# Altium schematic sheet speaker.SchDoc
size A4
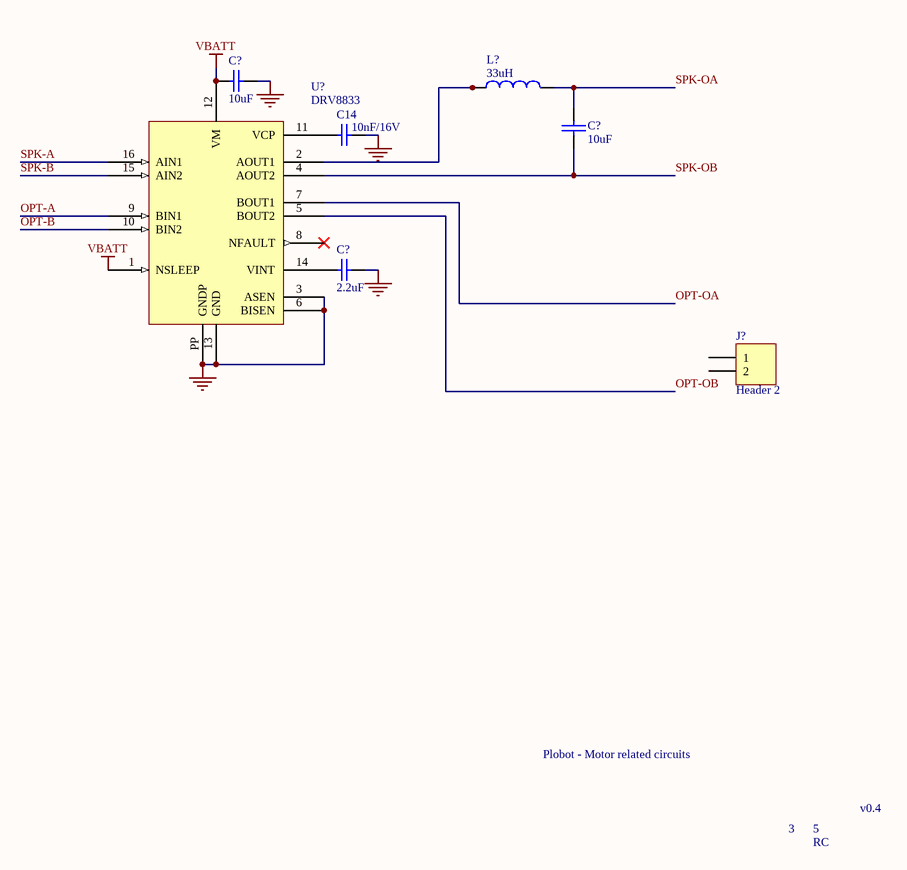
[diagram p0: speaker.SchDoc]

## Parts
(Parts that share a designator on the sheet are numbered #1, #2 ... from top to bottom, then left to right.)
C14  10nF/16V  [CAPC2012N]
C?#1  10uF  [CAPC3216N]
C?#2  10uF  [CAPC1608N]
C?#3  2.2uF  [CAPC2012N]
J?  Header 2  [HDR1X2]
L?  value 33uH  [INDC1005AL]  (hidden comment: Inductor)
U?  DRV8833  [DRV8833]

## Nets
GND: C14.1 C?#1.1 C?#3.1 U?.3(ASEN) U?.6(BISEN) U?.13(GND) U?.PP(GNDP)
VBATT: C?#1.2 U?.1(NSLEEP) U?.12(VM)
OPT-A: U?.9(BIN1)
OPT-B: U?.10(BIN2)
OPT-OA: U?.7(BOUT1)
OPT-OB: U?.5(BOUT2)
SPK-A: U?.16(AIN1)
SPK-B: U?.15(AIN2)
SPK-OA: C?#2.2 L?.2
SPK-OB: C?#2.1 U?.4(AOUT2)
NetC14_2: C14.2 U?.11(VCP)
NetC?#3_2: C?#3.2 U?.14(VINT)
NetL?_1: L?.1 U?.2(AOUT1)

Not connected (* = marked no-connect by the designer): J? 1 2; U? 8(NFAULT)*

## Notes on the sheet
- Plobot - Motor related circuits
- 3
- 5
- v0.4
- RC

## Library data of the parts
C14 C?#2 C?#3 = Cap: Capacitor
  C14: Published: 8-Jun-2000; LatestRevisionDate: 17-Jul-2002; LatestRevisionNote: Re-released for DXP Platform.; PackageReference: RAD-0.3; Publisher: Altium Limited; PackageDescription: Radial Cap, Thru-Hole; 2 Leads; 0.3 in Pin Spacing; Value: 10nF/16V
  C?#3: Published: 8-Jun-2000; LatestRevisionDate: 17-Jul-2002; LatestRevisionNote: Re-released for DXP Platform.; PackageReference: RAD-0.3; Publisher: Altium Limited; PackageDescription: Radial Cap, Thru-Hole; 2 Leads; 0.3 in Pin Spacing; Value: 2.2uF
C?#1 = Cap_2: Capacitor; Published: 8-Jun-2000; LatestRevisionDate: 17-Jul-2002; LatestRevisionNote: Re-released for DXP Platform.; PackageReference: RAD-0.3; Publisher: Altium Limited; PackageDescription: Radial Cap, Thru-Hole; 2 Leads; 0.3 in Pin Spacing; Value: 10uF
J? = Header 2: Header, 2-Pin; LatestRevisionDate: 17-Jul-2002; LatestRevisionNote: Re-released for DXP Platform.; Publisher: Altium Limited
L? = Inductor: Code_IEC: 1005; Published: 8-Jun-2000; LatestRevisionDate: 29-May-2009; LatestRevisionNote: IPC-7351 Footprint Added.; PackageReference: 0402-A; Publisher: Altium Limited; PackageDescription: Chip Inductor; Code_JEITA: 0402